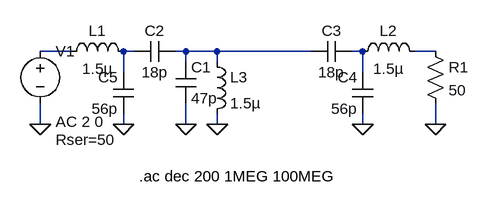
[diagram p0: schematic Beacon BP Filter.asc]
Beacon BP Filter.asc, the LTspice schematic file:
Version 4
SHEET 1 880 680
WIRE 32 112 -16 112
WIRE 128 112 112 112
WIRE 208 112 192 112
WIRE 256 112 208 112
WIRE 400 112 256 112
WIRE 480 112 464 112
WIRE 592 112 560 112
WIRE 208 128 208 112
WIRE 256 128 256 112
WIRE 112 144 112 112
WIRE 480 144 480 112
WIRE -16 224 -16 192
WIRE 112 224 112 208
WIRE 208 224 208 192
WIRE 256 224 256 208
WIRE 480 224 480 208
WIRE 592 224 592 192
FLAG 112 224 0
FLAG 208 224 0
FLAG 256 224 0
FLAG 480 224 0
FLAG -16 224 0
FLAG 592 224 0
SYMBOL ind 16 128 R270
WINDOW 0 32 56 VTop 2
WINDOW 3 5 56 VBottom 2
SYMATTR InstName L1
SYMATTR Value 1.5µ
SYMBOL ind 464 128 R270
WINDOW 0 32 56 VTop 2
WINDOW 3 5 56 VBottom 2
SYMATTR InstName L2
SYMATTR Value 1.5µ
SYMBOL ind 240 112 R0
SYMATTR InstName L3
SYMATTR Value 1.5µ
SYMBOL cap 192 128 R0
SYMATTR InstName C1
SYMATTR Value 47p
SYMBOL cap 192 96 R90
WINDOW 0 0 32 VBottom 2
WINDOW 3 32 32 VTop 2
SYMATTR InstName C2
SYMATTR Value 18p
SYMBOL cap 464 96 R90
WINDOW 0 0 32 VBottom 2
WINDOW 3 32 32 VTop 2
SYMATTR InstName C3
SYMATTR Value 18p
SYMBOL cap 496 208 R180
WINDOW 0 24 56 Left 2
WINDOW 3 24 8 Left 2
SYMATTR InstName C4
SYMATTR Value 56p
SYMBOL cap 128 208 R180
WINDOW 0 24 56 Left 2
WINDOW 3 24 8 Left 2
SYMATTR InstName C5
SYMATTR Value 56p
SYMBOL res 576 96 R0
SYMATTR InstName R1
SYMATTR Value 50
SYMBOL voltage -16 96 R0
WINDOW 123 24 124 Left 2
WINDOW 39 24 152 Left 2
SYMATTR InstName V1
SYMATTR Value ""
SYMATTR Value2 AC 2 0
SYMATTR SpiceLine Rser=50
TEXT 136 304 Left 2 !.ac dec 200 1MEG 100MEG

The netlist it stands for:
* Beacon BP Filter.asc
L1 N001 N002 1.5µ
L2 N004 N005 1.5µ
L3 N003 0 1.5µ
C1 N003 0 47p
C2 N003 N002 18p
C3 N004 N003 18p
C4 0 N004 56p
C5 0 N002 56p
R1 N005 0 50
V1 N001 0 AC 2 0 Rser=50
.ac dec 200 1MEG 100MEG
.backanno
.end